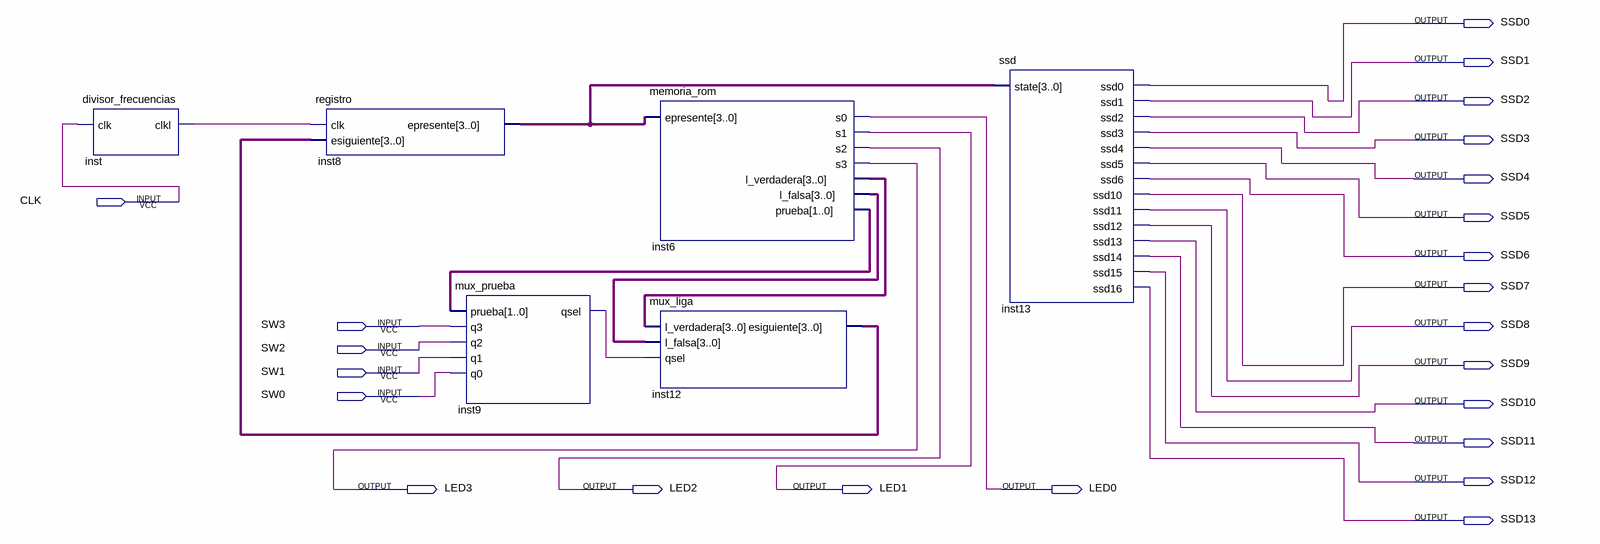
[diagram p0: schematic sheet]
// Quartus schematic Practica3.bdf as structural Verilog: 6 symbols, 23 pins
module Practica3 (
  input  CLK,
  input  SW3,
  input  SW2,
  input  SW1,
  input  SW0,
  output SSD0,
  output SSD1,
  output SSD2,
  output SSD3,
  output SSD4,
  output SSD5,
  output SSD6,
  output SSD7,
  output SSD8,
  output SSD9,
  output SSD10,
  output SSD11,
  output SSD12,
  output LED3,
  output LED2,
  output LED1,
  output LED0,
  output SSD13
);

  wire inst9_qsel, inst_clkl;
  wire [1:0] inst6_prueba;
  wire [3:0] inst6_l_falsa, inst6_l_verdadera, inst8_epresente, inst12_esiguiente;

  divisor_frecuencias inst (.clk(CLK), .clkl(inst_clkl));
  registro inst8 (.clk(inst_clkl), .esiguiente(inst12_esiguiente), .epresente(inst8_epresente));
  mux_prueba inst9 (.prueba(inst6_prueba), .q3(SW3), .q2(SW2), .q1(SW1), .q0(SW0), .qsel(inst9_qsel));
  memoria_rom inst6 (
    .epresente(inst8_epresente), .s0(LED0), .s1(LED1), .s2(LED2), .s3(LED3), .l_verdadera(inst6_l_verdadera),
    .l_falsa(inst6_l_falsa), .prueba(inst6_prueba));
  mux_liga inst12 (
    .l_verdadera(inst6_l_verdadera), .l_falsa(inst6_l_falsa), .qsel(inst9_qsel),
    .esiguiente(inst12_esiguiente));
  ssd inst13 (
    .state(inst8_epresente), .ssd0(SSD0), .ssd1(SSD1), .ssd2(SSD2), .ssd3(SSD3), .ssd4(SSD4), .ssd5(SSD5),
    .ssd6(SSD6), .ssd10(SSD7), .ssd11(SSD8), .ssd12(SSD9), .ssd13(SSD10), .ssd14(SSD11), .ssd15(SSD12),
    .ssd16(SSD13));
endmodule
